# EAGLE design secondaire (EAGLE 6.3)
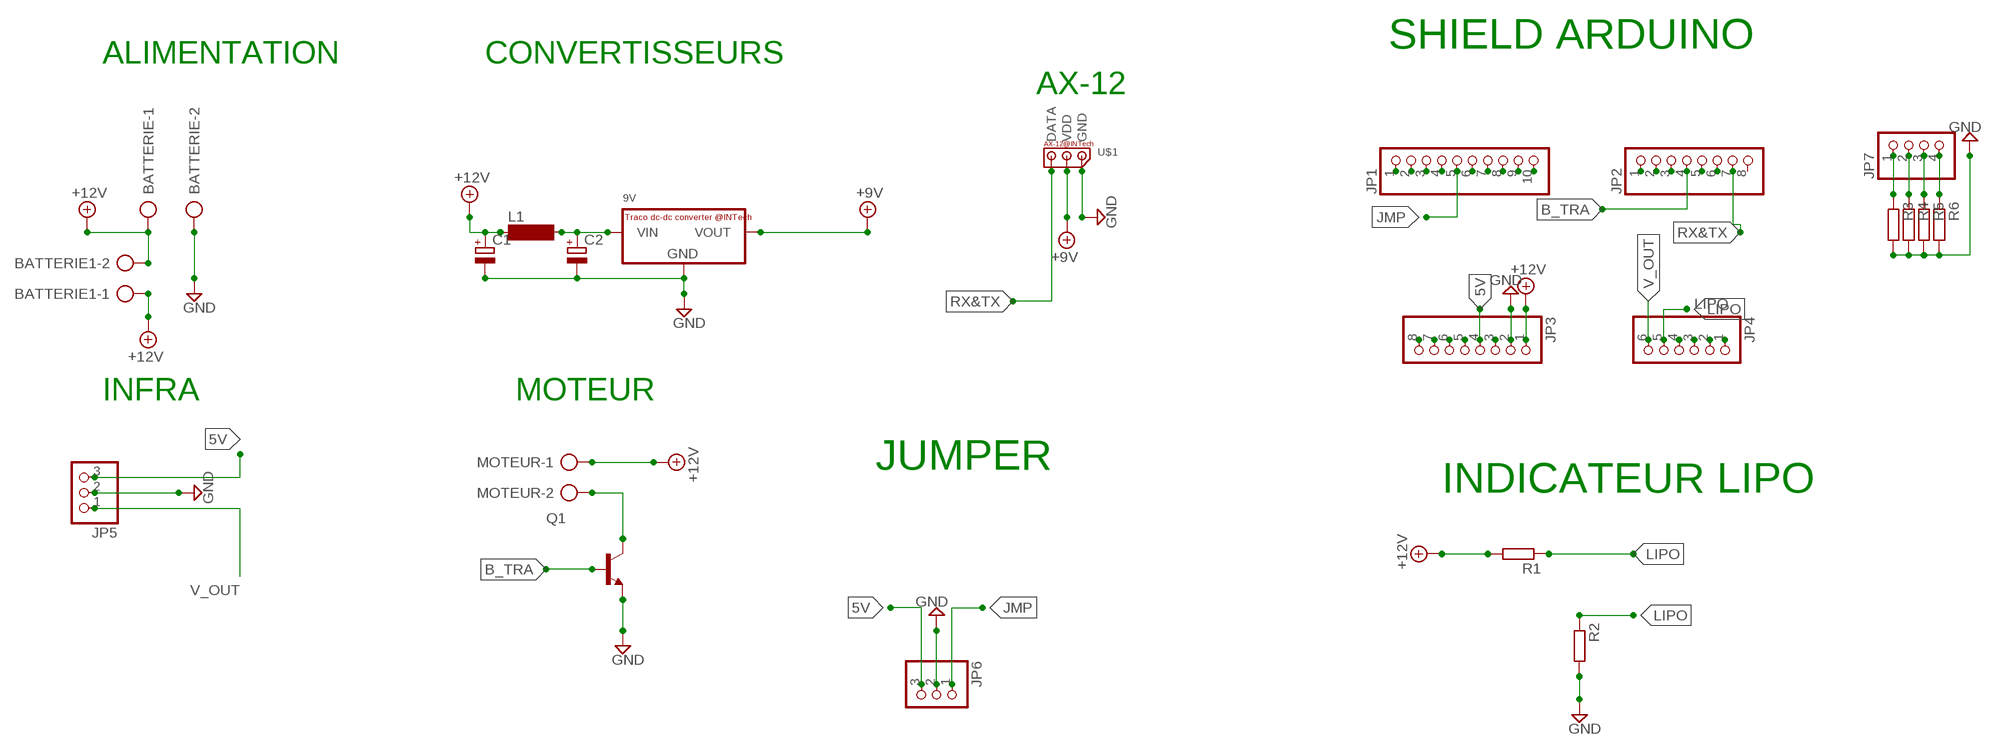
[diagram p0: schematic, sheet 1]

## Parts
9V  R-78C-1.0_INTECH  [SIP3_INTECH]
BATTERIE  AK300/2  [AK300/2]
BATTERIE1  AK300/2  [AK300/2]
C1  CPOL-EUE2.5-6  [E2,5-6]
C2  CPOL-EUE2.5-6  [E2,5-6]
JP1  PINHD-1X10  [1X10]
JP2  PINHD-1X8  [1X08]
JP3  PINHD-1X8  [1X08]
JP4  PINHD-1X6  [1X06]
JP5  PINHD-1X3  [1X03]
JP6  PINHD-1X3  [1X03]
JP7  PINHD-1X4  [1X04]
L1  SD12-1000  [SD12_1000]
MOTEUR  AK300/2  [AK300/2]
Q1  BC237-NPN-TO92-CBE  [TO92-CBE]
R1  R-EU_0204/7  [0204/7]
R2  R-EU_0204/7  [0204/7]
R3  R-EU_0204/7  [0204/7]
R4  R-EU_0204/7  [0204/7]
R5  R-EU_0204/7  [0204/7]
R6  R-EU_0204/7  [0204/7]
U$1  AX-12_CF_INTECH  [AX-12_CF_INTECH]

## Nets
5V: JP3.4 JP5.3 JP6.3
+9V: 9V.VOUT U$1.VDD
+12V: BATTERIE1.1 BATTERIE1.2 BATTERIE.1 C1.+ JP3.1 L1.1 MOTEUR.1 R1.2
B_TRA: JP2.4 Q1.B
COL: MOTEUR.2 Q1.C
GND: 9V.GND BATTERIE.2 C1.- C2.- JP3.2 JP5.2 JP6.2 Q1.E R2.2 R3.2 R4.2 R5.2 R6.2 U$1.GND
JMP: JP1.5 JP6.1
LIPO: JP4.5 R1.1 R2.1
N$2: JP2.1
N$3: 9V.VIN C2.+ L1.2
N$4: JP1.1
N$5: JP1.2
N$6: JP1.10
N$7: JP1.4
N$8: JP4.4
N$10: JP1.6
N$11: JP1.7
N$12: JP1.8
N$13: JP1.9
N$14: JP7.1 R3.1
N$15: JP2.2
N$16: JP2.3
N$17: JP7.2 R4.1
N$18: JP2.5
N$19: JP2.6
N$20: JP7.3 R5.1
N$21: JP7.4 R6.1
N$22: JP1.3
N$24: JP3.8
N$26: JP3.7
N$29: JP3.6
N$30: JP3.5
N$32: JP3.3
N$38: JP4.3
N$39: JP4.2
N$40: JP4.1
RX&TX: JP2.7 U$1.DATA
V_OUT: JP4.6 JP5.1
Unconnected: JP2.8

## Notes on the sheet
- SHIELD ARDUINO
- ALIMENTATION | CONVERTISSEURS
- AX-12
- INFRA | MOTEUR
- JUMPER
- INDICATEUR LIPO

## Library data of the parts
9V = INTech:R-78C*-1.0_INTECH: Convertisseur dc-dc Traco
BATTERIE BATTERIE1 MOTEUR = con-ptr500:AK300/2: CONNECTOR; OC_FARNELL: unknown; OC_NEWARK: unknown
C1 C2 = resistor:CPOL-EU: POLARIZED CAPACITOR, European symbol
JP1 = pinhead:PINHD-1X10: PIN HEADER
JP2 JP3 = pinhead:PINHD-1X8: PIN HEADER
JP4 = pinhead:PINHD-1X6: PIN HEADER
JP5 JP6 = pinhead:PINHD-1X3: PIN HEADER
JP7 = pinhead:PINHD-1X4: PIN HEADER
L1 = inductor-neosid:SD12: INDUCTOR nominal inductance; OC_FARNELL: unknown; OC_NEWARK: unknown
Q1 = transistor:*-NPN-: NPN Transistror BF959 corrected 2008.03.06
R1-R6 = resistor:R-EU_: RESISTOR, European symbol
U$1 = INTech:AX-12_CF_INTECH: Connecteur wire-to-board 3 points pour servo-moteurs Dynamixel AX-12

## Board
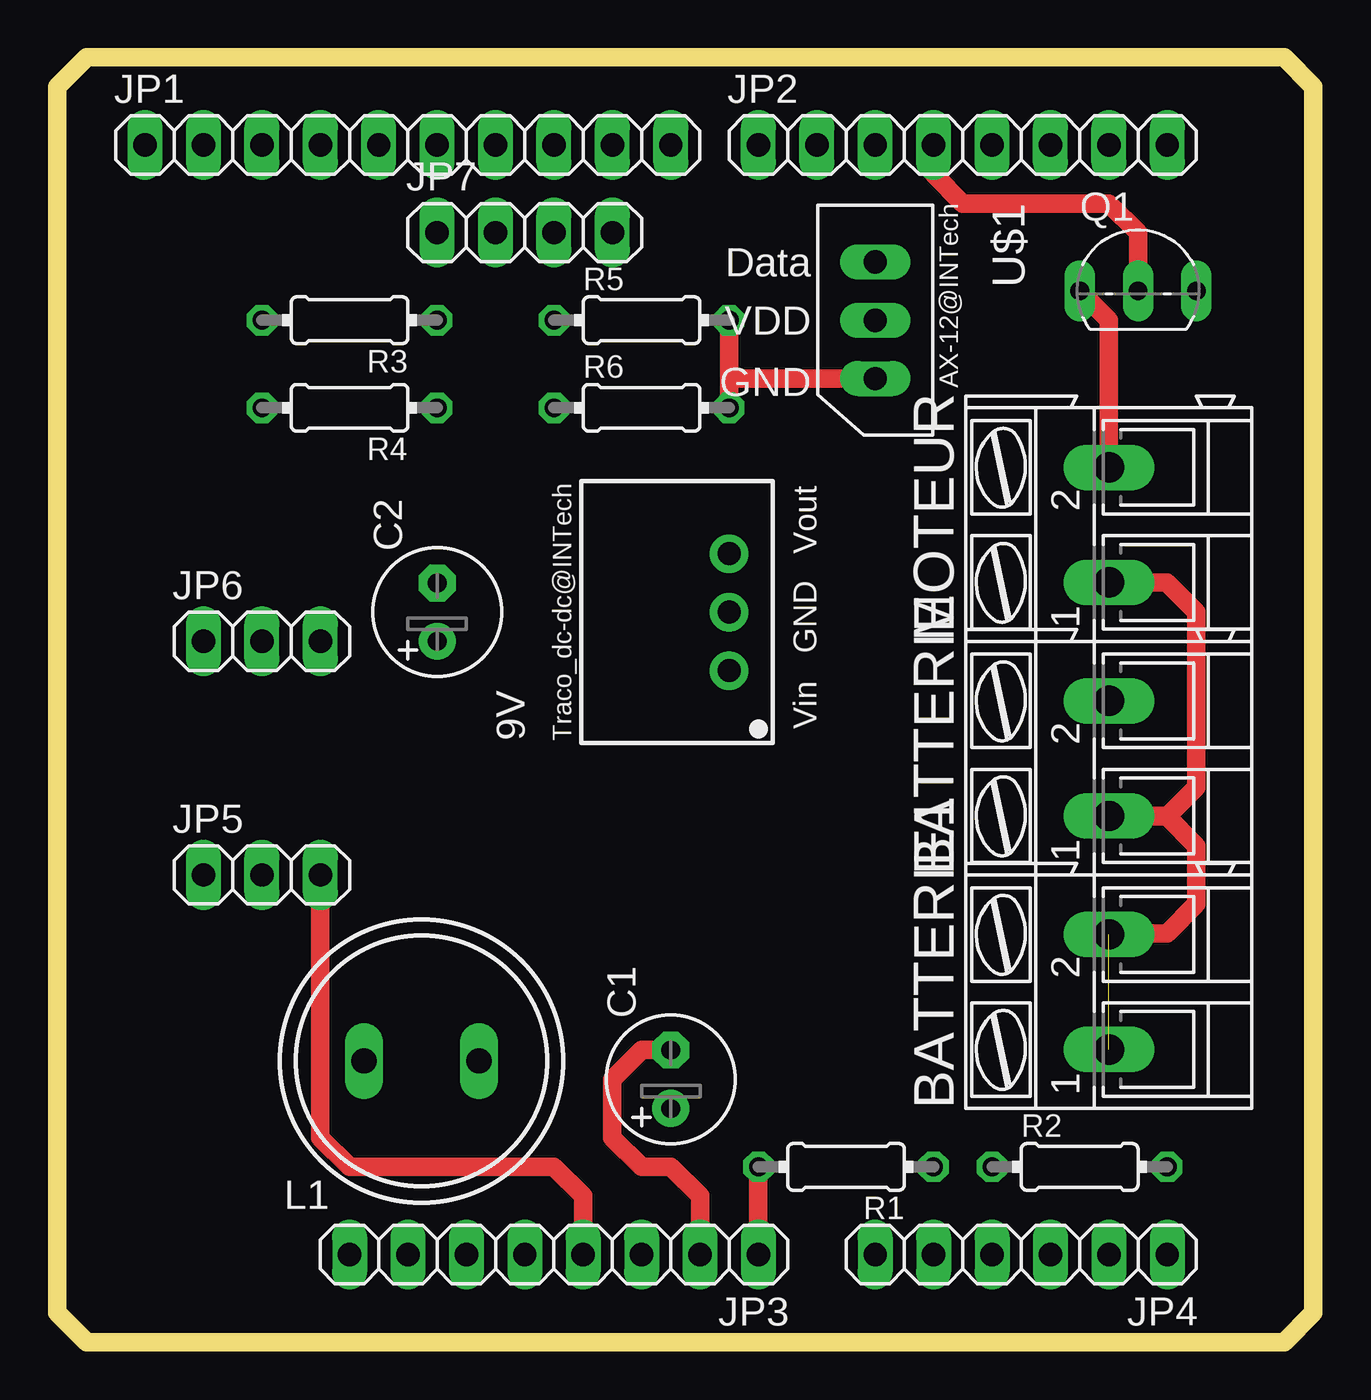
[diagram p1: board, top side]
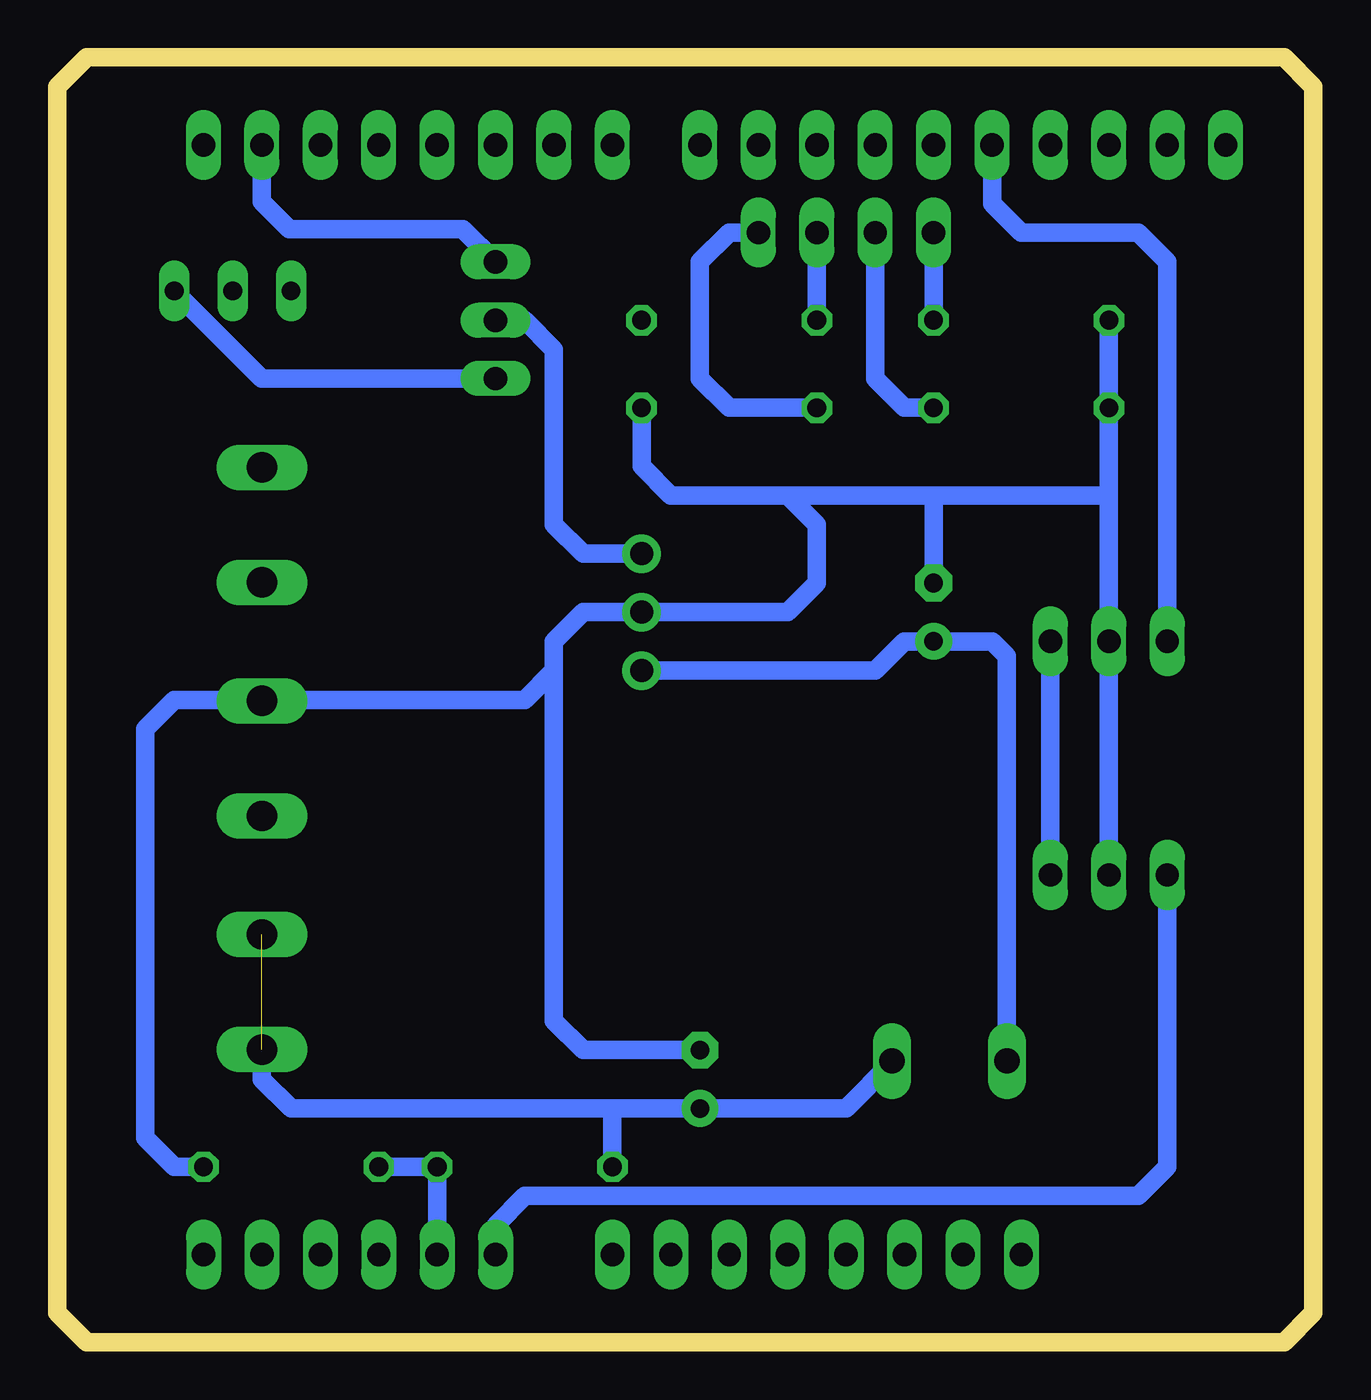
[diagram p2: board, bottom side, seen from below]

Size 54.61 x 55.88 mm. Coordinates in mm from the lower left corner, seen from the top.
Outline: 0,1.27 1.27,0 53.34,0 54.61,1.27 54.61,54.61 53.34,55.88 1.27,55.88 0,54.61 0,1.27
Copper layers (1*16): Top 0.035mm / dielectric 1.5mm / Bottom 0.035mm
Design rules "default": minimum track width 10mil, minimum drill 24mil, track to track 8mil, track to pad 8mil, pad to pad 8mil, via to via 8mil, smd to smd 8mil, copper to edge 40mil, drill to drill 8mil, minimum pad ring 10mil, minimum via ring 8mil, stop-mask expansion 4mil, vias tented up to drill 0mil, thermal gap 10mil

### Footprints (pad centres in the part's own frame; a part is rotated, then mirrored left to right if it is on the bottom)
SIP3_INTECH = drill 1 pad 1.676: GND 0,0; VIN -2.54,0; VOUT 2.54,0
AK300/2 = drill 1.321 long: 1 -2.515,0; 2 2.489,0
E2,5-6 = drill 0.813 pad 1.6: + -1.27,0 | drill 0.813 pad 1.6 octagon: - 1.27,0
1X10 = drill 1.016 long: 1 -11.43,0; 2 -8.89,0; 3 -6.35,0; 4 -3.81,0; 5 -1.27,0; 6 1.27,0; 7 3.81,0; 8 6.35,0; 9 8.89,0; 10 11.43,0
1X08 = drill 1.016 long: 1 -8.89,0; 2 -6.35,0; 3 -3.81,0; 4 -1.27,0; 5 1.27,0; 6 3.81,0; 7 6.35,0; 8 8.89,0
1X06 = drill 1.016 long: 1 -6.35,0; 2 -3.81,0; 3 -1.27,0; 4 1.27,0; 5 3.81,0; 6 6.35,0
1X03 = drill 1.016 long: 1 -2.54,0; 2 0,0; 3 2.54,0
1X04 = drill 1.016 long: 1 -3.81,0; 2 -1.27,0; 3 1.27,0; 4 3.81,0
SD12_1000 = drill 1.1 long: 1 -2.5,0; 2 2.5,0
TO92-CBE = drill 0.813 long: B 0,0; C -2.54,0; E 2.54,0
0204/7 = drill 0.813 octagon: 1 -3.81,0; 2 3.81,0
AX-12_CF_INTECH = drill 1.016 long: DATA -2.54,0; GND 2.54,0; VDD 0,0

### Placement (x,y rotation side)
9V  29.21,31.75 90 top
BATTERIE  45.72,25.4 90 top
BATTERIE1  45.72,15.24 90 top
C1  26.67,11.43 90 top
C2  16.51,31.75 90 top
JP1  15.24,52.07 0 top
JP2  39.37,52.07 0 top
JP3  21.59,3.81 180 top
JP4  41.91,3.81 180 top
JP5  8.89,20.32 0 top
JP6  8.89,30.48 0 top
JP7  20.32,48.26 0 top
L1  15.82,12.23 180 top
MOTEUR  45.72,35.56 90 top
Q1  46.99,45.72 0 top
R1  34.29,7.62 180 top
R2  44.45,7.62 0 top
R3  12.7,44.45 180 top
R4  12.7,40.64 180 top
R5  25.4,44.45 0 top
R6  25.4,40.64 0 top
U$1  35.56,44.45 270 top

### Tracks (layer width: path | path; a pad name or v marks a point on that pad's centre or on a via)
5V
  Top 0.813: JP5.3 11.43,8.89 12.7,7.62 21.59,7.62 22.86,6.35 JP3.4
  Bottom 0.813: JP6.3 JP5.3
+9V
  Bottom 0.813: U$1.VDD 34.29,44.45 33.02,43.18 33.02,35.56 31.75,34.29 9V.VOUT
+12V  (1 unrouted)
  Top 0.813: JP3.1 R1.2 | MOTEUR.1 48.23,33.05 49.53,31.75 49.53,24.13 48.26,22.86 45.74,22.86 BATTERIE.1 48.23,22.89 49.53,21.59 49.53,19.05 48.26,17.78 45.77,17.78 BATTERIE1.2
  Bottom 0.813: L1.1 18.32,12.16 20.32,10.16 C1.+ 30.48,10.16 | BATTERIE1.1 45.72,11.43 44.45,10.16 30.48,10.16 | R1.2 30.48,10.16
B_TRA
  Top 0.813: JP2.4 38.1,50.8 39.37,49.53 45.72,49.53 46.99,48.26 Q1.B
COL
  Top 0.813: Q1.C 45.72,44.45 MOTEUR.2
GND
  Top 0.813: R5.2 29.21,41.91 | 29.21,41.91 R6.2 | U$1.GND 29.21,41.91 | C1.- 25.4,12.7 24.13,11.43 24.13,8.89 25.4,7.62 26.67,7.62 27.94,6.35 JP3.2
  Bottom 0.813: Q1.E 45.72,41.91 U$1.GND | R3.2 R4.2 8.89,36.83 | 8.89,36.83 JP6.2 JP5.2 | 22.86,36.83 21.59,35.56 21.59,33.02 22.86,31.75 9V.GND 31.75,31.75 33.02,30.48 33.02,29.21 | 22.86,36.83 16.51,36.83 | 16.51,36.83 8.89,36.83 | 33.02,29.21 34.29,27.94 45.67,27.94 BATTERIE.2 45.72,27.94 49.53,27.94 50.8,26.67 50.8,8.89 49.53,7.62 R2.2 | R6.2 29.21,38.1 27.94,36.83 22.86,36.83 | C2.- 16.51,36.83 | C1.- 31.75,12.7 33.02,13.97 33.02,29.21
JMP
  Bottom 0.813: JP6.1 6.35,46.99 7.62,48.26 12.7,48.26 13.97,49.53 JP1.5
LIPO
  Bottom 0.813: R2.1 R1.1 JP4.5
N$3
  Bottom 0.813: 9V.VIN 19.05,29.21 17.78,30.48 C2.+ 13.97,30.48 13.32,29.83 L1.2
N$14
  Bottom 0.813: R3.1 JP7.1
N$17
  Bottom 0.813: R4.1 17.78,40.64 19.05,41.91 JP7.2
N$20
  Bottom 0.813: JP7.3 R5.1
N$21
  Bottom 0.813: JP7.4 25.4,48.26 26.67,46.99 26.67,41.91 25.4,40.64 R6.1
RX&TX
  Bottom 0.813: JP2.7 45.72,49.6 44.52,48.41 36.98,48.41 U$1.DATA
V_OUT
  Bottom 0.813: JP5.1 6.35,7.62 7.62,6.35 34.29,6.35 35.56,5.08 JP4.6

### Text on the board
Reference: MOT | C | NC | NO | - | A0 | GND | 5V | 12V | + | AU
231bmp: D:/INTech/intech_logo.bmp